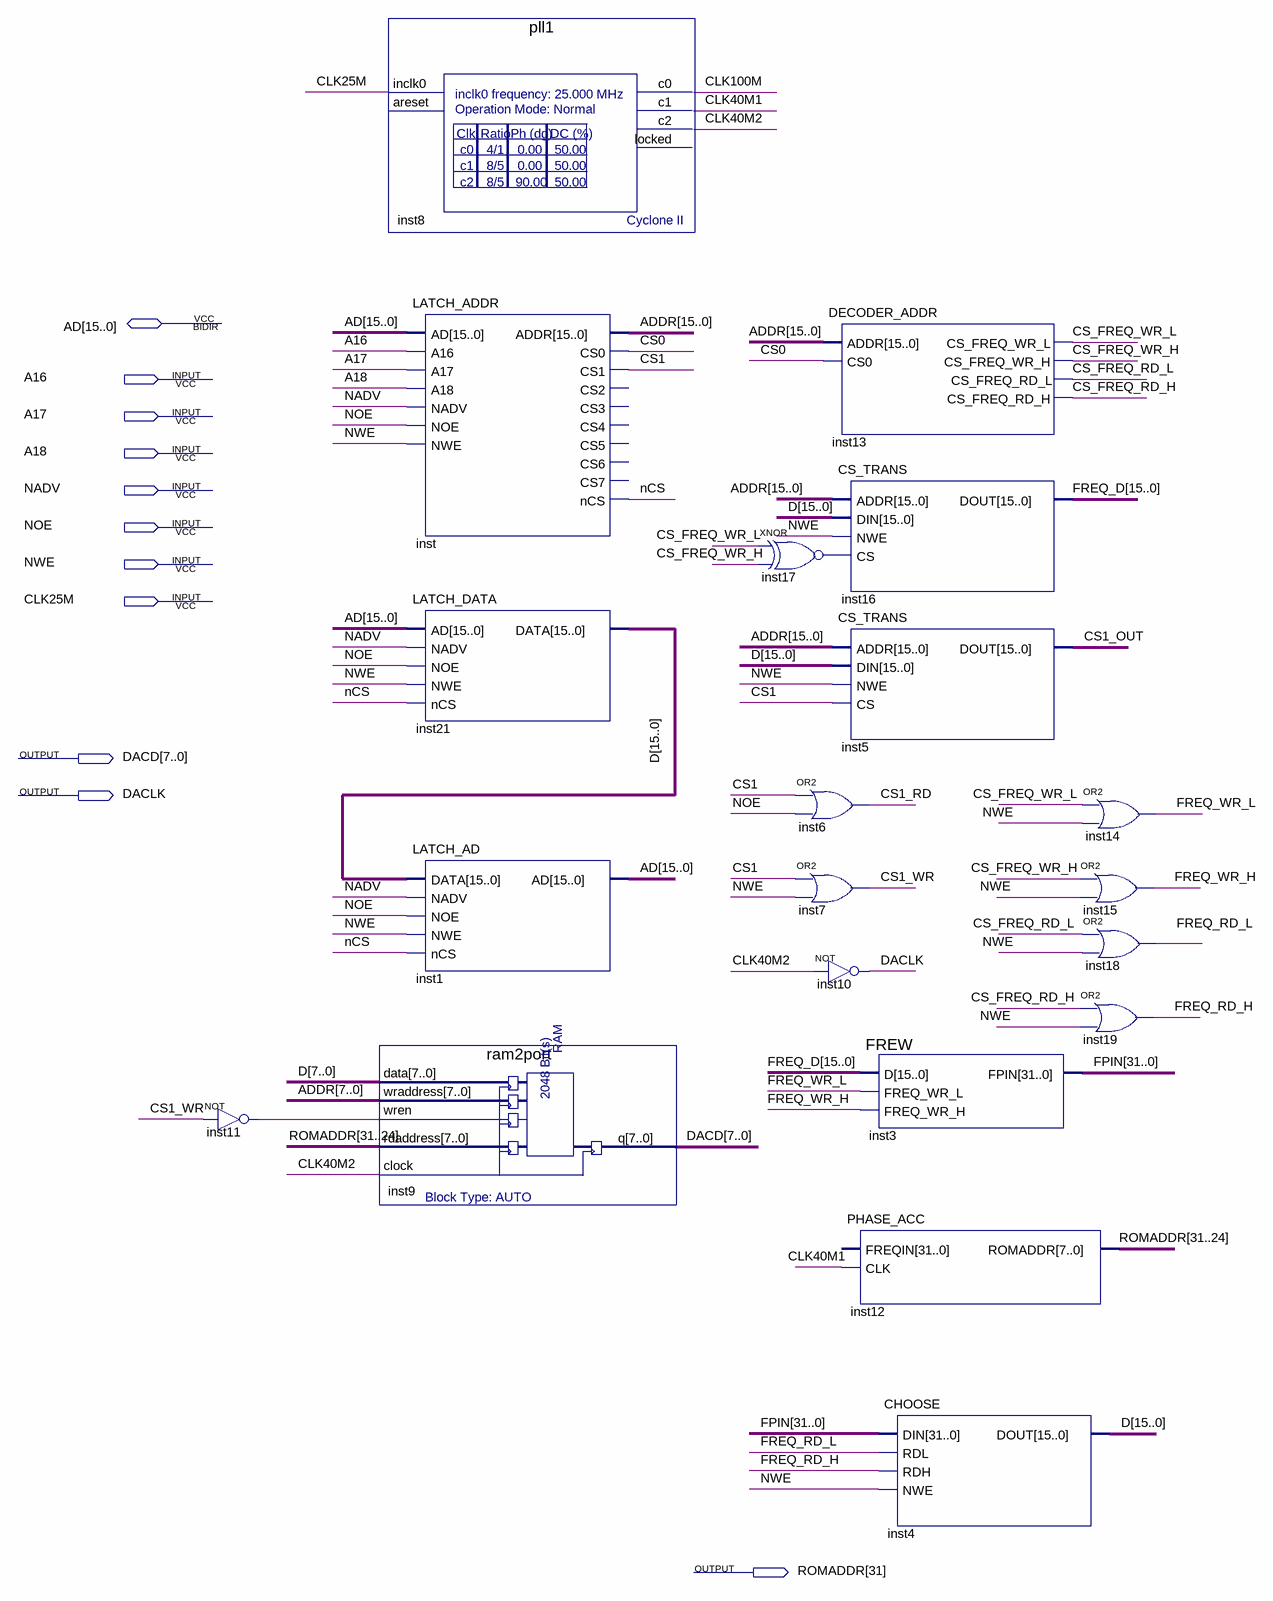
[diagram p0: schematic sheet]
// Quartus schematic DDS.bdf as structural Verilog: 20 symbols, 11 pins
module DDS (
  input  A16,
  input  A17,
  input  A18,
  input  NADV,
  input  NOE,
  input  NWE,
  input  CLK25M,
  inout  [15:0] AD,
  output [7:0] DACD,
  output DACLK,
  output [31:24] ROMADDR
);

  wire CLK40M1, CLK40M2, CLK100M, CS0, CS1, CS1_OUT, CS1_RD, CS1_WR, CS_FREQ_RD_H, CS_FREQ_RD_L,
       CS_FREQ_WR_H, CS_FREQ_WR_L, FREQ_RD_H, FREQ_RD_L, FREQ_WR_H, FREQ_WR_L, inst11_out, inst17_out, nCS;
  wire [15:0] ADDR, D, FREQ_D;
  wire [31:0] FPIN;

  not inst11 (inst11_out, CS1_WR);
  pll1 inst8 (.inclk0(CLK25M), .c0(CLK100M), .c1(CLK40M1), .c2(CLK40M2));  // open: areset, locked
  LATCH_ADDR inst (
    .AD(AD), .A16(A16), .A17(A17), .A18(A18), .NADV(NADV), .NOE(NOE), .NWE(NWE), .ADDR(ADDR), .CS0(CS0),
    .CS1(CS1), .nCS(nCS));  // open: CS2, CS3, CS4, CS5, CS6, CS7
  LATCH_DATA inst21 (.AD(AD), .NADV(NADV), .NOE(NOE), .NWE(NWE), .nCS(nCS), .DATA(D));
  LATCH_AD inst1 (.DATA(D), .NADV(NADV), .NOE(NOE), .NWE(NWE), .nCS(nCS), .AD(AD));
  ram2port inst9 (
    .data(D[7:0]), .wraddress(ADDR[7:0]), .wren(inst11_out), .rdaddress(ROMADDR), .clock(CLK40M2), .q(DACD));
  xnor inst17 (inst17_out, CS_FREQ_WR_L, CS_FREQ_WR_H);
  or inst6 (CS1_RD, CS1, NOE);
  or inst7 (CS1_WR, CS1, NWE);
  not inst10 (DACLK, CLK40M2);
  DECODER_ADDR inst13 (
    .ADDR(ADDR), .CS0(CS0), .CS_FREQ_WR_L(CS_FREQ_WR_L), .CS_FREQ_WR_H(CS_FREQ_WR_H),
    .CS_FREQ_RD_L(CS_FREQ_RD_L), .CS_FREQ_RD_H(CS_FREQ_RD_H));
  CS_TRANS inst16 (.ADDR(ADDR), .DIN(D), .NWE(NWE), .CS(inst17_out), .DOUT(FREQ_D));
  CS_TRANS inst5 (.ADDR(ADDR), .DIN(D), .NWE(NWE), .CS(CS1), .DOUT(CS1_OUT));
  FREW inst3 (.D(FREQ_D), .FREQ_WR_L(FREQ_WR_L), .FREQ_WR_H(FREQ_WR_H), .FPIN(FPIN));
  PHASE_ACC inst12 (.CLK(CLK40M1), .ROMADDR(ROMADDR));  // open: FREQIN
  CHOOSE inst4 (.DIN(FPIN), .RDL(FREQ_RD_L), .RDH(FREQ_RD_H), .NWE(NWE), .DOUT(D));
  or inst14 (FREQ_WR_L, CS_FREQ_WR_L, NWE);
  or inst15 (FREQ_WR_H, CS_FREQ_WR_H, NWE);
  or inst18 (FREQ_RD_L, CS_FREQ_RD_L, NWE);
  or inst19 (FREQ_RD_H, CS_FREQ_RD_H, NWE);
endmodule
